# EAGLE design board (EAGLE 6.1)
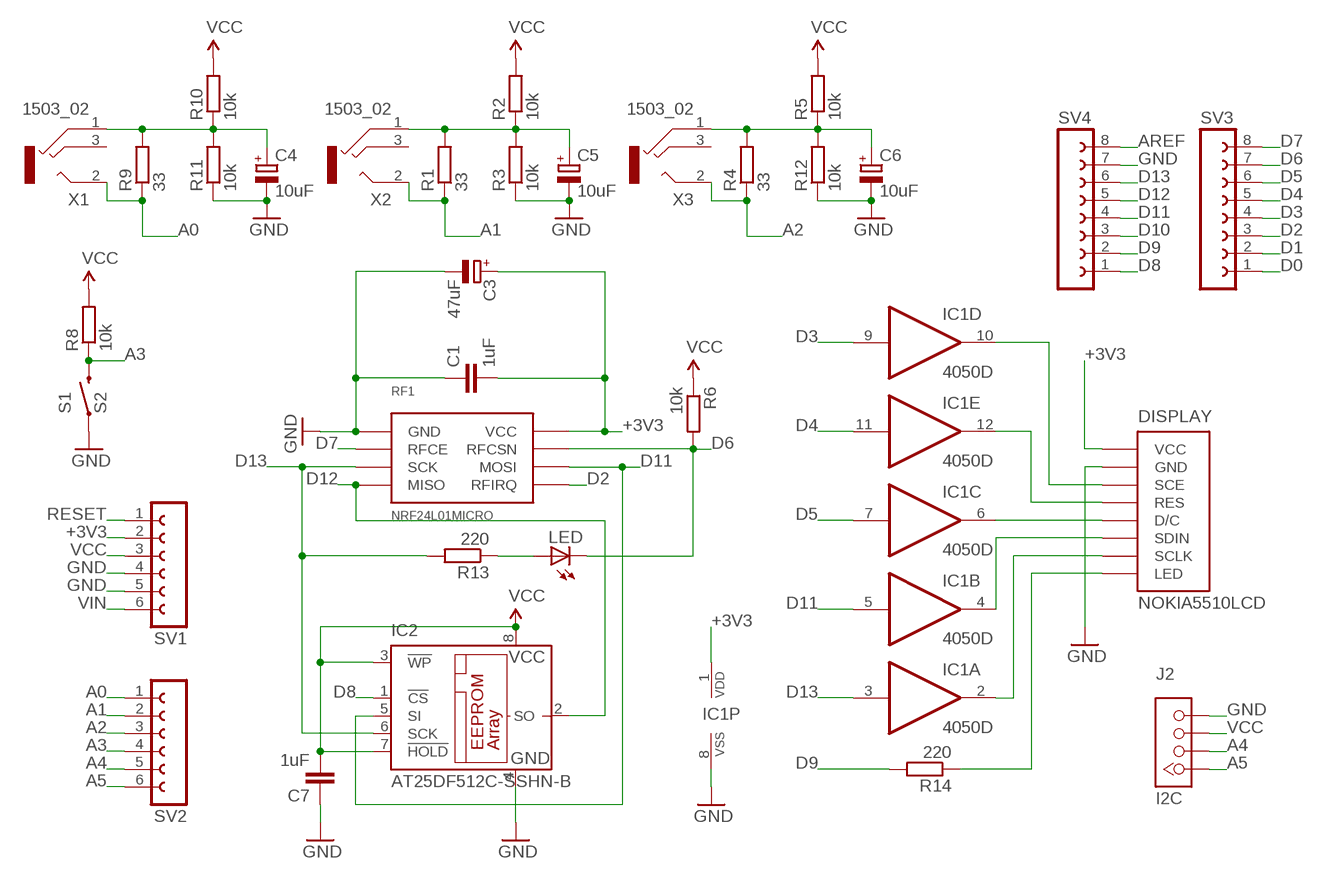
[diagram p0: schematic, sheet 1]

## Parts
C1  1uF  C-EUC0805  [C0805]
C3  47uF  CPOL-EU153CLV-0405  [153CLV-0405]
C4  10uF  CPOL-EU153CLV-0405  [153CLV-0405]
C5  10uF  CPOL-EU153CLV-0405  [153CLV-0405]
C6  10uF  CPOL-EU153CLV-0405  [153CLV-0405]
C7  1uF  C-EUC0805  [C0805]
DISPLAY  NOKIA5510LCD  NOKIA5510LCD-BLUE  [NOKIA5510LCD-BLUE]
IC1  4050D  [SO16]
IC2  AT25DF512C-SSHN-B  25AA080SN  [SO-08]
J2  I2C  TWIG-4P-2.0C  [TWIG-4P-2.0C]
LED  LEDCHIPLED_0805  [CHIPLED_0805]
R1  33  R-EU_M0805  [M0805]
R2  10k  R-EU_M0805  [M0805]
R3  10k  R-EU_M0805  [M0805]
R4  33  R-EU_M0805  [M0805]
R5  10k  R-EU_M0805  [M0805]
R6  10k  R-EU_M0805  [M0805]
R8  10k  R-EU_M0805  [M0805]
R9  33  R-EU_M0805  [M0805]
R10  10k  R-EU_M0805  [M0805]
R11  10k  R-EU_M0805  [M0805]
R12  10k  R-EU_M0805  [M0805]
R13  220  R-EU_M0805  [M0805]
R14  220  R-EU_M0805  [M0805]
RF1  NRF24L01MICRO  [MICRO-RF24]
S1  S2  SWITCH-MOMENTARY-2SIDE_EZ  [TACTILE-PTH-SIDEEZ]
SV1  FE06-1  [FE06]
SV2  FE06-1  [FE06]
SV3  FE08-1  [FE08]
SV4  FE08-1  [FE08]
X1  1503_02  [1503_02]
X2  1503_02  [1503_02]
X3  1503_02  [1503_02]

## Nets
1: C4.+ R9.2 R10.1 R11.2 X1.1
2: C5.+ R1.2 R2.1 R3.2 X2.1
3: C6.+ R4.2 R5.1 R12.2 X3.1
+3V3: C1.2 C3.+ DISPLAY.VCC IC1.1(P:VDD) RF1.3V3(VCC) SV1.2
A0: R9.1 SV2.1 X1.2
A1: R1.1 SV2.2 X2.2
A2: R4.1 SV2.3 X3.2
A3: R8.1 S1.2 SV2.4
A4: J2.P$2 SV2.5
A5: J2.P$1 SV2.6
AREF: SV4.8
CSE: DISPLAY.CE(SCE) IC1.10(D:O)
D0: SV3.1
D1: SV3.2
D2: RF1.IRQ(RFIRQ) SV3.3
D3: IC1.9(D:I) SV3.4
D4: IC1.11(E:I) SV3.5
D5: IC1.7(C:I) SV3.6
D6: LED.C R6.2 RF1.CSN(RFCSN) SV3.7
D7: RF1.CE(RFCE) SV3.8
D8: IC2.1(!CS) SV4.1
D9: R14.2 SV4.2
D10: SV4.3
D11: IC1.5(B:I) IC2.5(SI) RF1.MOSI SV4.4
D12: IC2.2(SO) RF1.MISO SV4.5
D13: IC1.3(A:I) IC2.6(SCK) R13.2 RF1.SCK SV4.6
GND: C1.1 C3.- C4.- C5.- C6.- C7.1 DISPLAY.GND IC1.8(P:VSS) IC2.4(GND) J2.P$4 R3.1 R11.1 R12.1 RF1.GND S1.1 SV1.4 SV1.5 SV4.7
N$2: DISPLAY.BL(LED) R14.1
N$3: LED.A R13.1
N$4: DISPLAY.DC(D/C) IC1.6(C:O)
N$5: DISPLAY.DIN(SDIN) IC1.4(B:O)
N$6: DISPLAY.CLK(SCLK) IC1.2(A:O)
RESET: SV1.1
RST: DISPLAY.RST(RES) IC1.12(E:O)
VCC: C7.2 IC2.3(!WP) IC2.7(!HOLD) IC2.8(VCC) J2.P$3 R2.2 R5.2 R6.1 R8.2 R10.2 SV1.3
VIN: SV1.6
Unconnected: IC1.14(F:I) IC1.15(F:O) X1.2@2 X1.3 X2.2@2 X2.3 X3.2@2 X3.3

## Library data of the parts
C1 C7 = rcl:C-EU: CAPACITOR, European symbol
C3-C6 = rcl:CPOL-EU: POLARIZED CAPACITOR, European symbol
DISPLAY = matrix:NOKIA5510LCD-BLUE
IC1 = 40xx:4050: Hex non-inverting BUFFER
IC2 = microchip:25*: Serial EEPROM 4K/ 8K , SPI bus; MF: MICROCHIP; MPN: 25AA080/SN; OC_FARNELL: 1816072; OC_NEWARK: 92C7351
J2 = matrix:TWIG-4P-2.0
LED = adafruit:LED: LED OSRAM: - CHIPLED LG R971, LG N971, LY N971, LG Q971, LY Q971, LO R971, LY R971 LH N974, LH R974 LS Q976, LO Q976, LY Q976 LO Q996 - Hyper CHIPLED LW Q18S LB Q993, LB Q99A, LB R99A - SideLED LS A670, LO A670, LY A670, LG A670, LP A670 LB A673, LV A673, LT A673, LW A673 LH A674 LY A675 LS A676, LA A676, LO A676, LY A676, LW A676 LS A679, LY A679, LG A679 - Hyper Micro SIDELED® LS Y876, LA Y876, LO Y876, LY Y876 LT Y87S - SmartLED LW L88C, LW L88S LB L89C, LB L89S, LG L890 LS L89K, LO L89K, LY L89K LS L896, LA L896, LO L896, LY L896 - TOPLED LS T670, LO T670, LY T670, LG T670, LP T670 LSG T670, LSP T670, LSY T670, LOP T670, LYG T670 LG T671, LOG T671, LSG T671 LB T673, LV T673, LT T673, LW T673 LH T674 LS T676, LA T676, LO T676, LY T676, LB T676, LH T676, LSB T676, LW T676 LB T67C, LV T67C, LT T67C, LS T67K, LO T67K, LY T67K, LW E67C LS E67B, LA E67B, LO E67B, LY E67B, LB E67C, LV E67C, LT E67C LW T67C LS T679, LY T679, LG T679 LS T770, LO T770, LY T770, LG T770, LP T770 LB T773, LV T773, LT T773, LW T773 LH T774 LS E675, LA E675, LY E675, LS T675 LS T776, LA T776, LO T776, LY T776, LB T776 LHGB T686 LT T68C, LB T68C - Hyper Mini TOPLED® LB M676 - Mini TOPLED Santana® LG M470 LS M47K, LO M47K, LY M47K Source: http://www.osram.convergy.de/
R1-R6 R8-R14 = rcl:R-EU_: RESISTOR, European symbol
RF1 = matrix:NRF24L01
S1 = SparkFun-Electromechanical:SWITCH-MOMENTARY-2: Various NO switches- pushbuttons, reed, etc
SV1 SV2 = con-lsta:FE06-1: FEMALE HEADER; OC_FARNELL: unknown; OC_NEWARK: unknown
SV3 SV4 = con-lsta:FE08-1: FEMALE HEADER; OC_FARNELL: unknown; OC_NEWARK: unknown
X1-X3 = con-lumberg-my:1503_02: Jack connectors according to JISC 6560, 3.5 mm Klinkeneinbaukupplung nach JISC 6560, 3,5 mm, 3-polig/stereo, abgewinkelte Ausführung, Surface-Mount-Technik (SMT) Source: http://www.lumberg.com/Produkte/PDFs/1503_02.pdf; OC_FARNELL: 1216979; OC_NEWARK: unknown

## Board
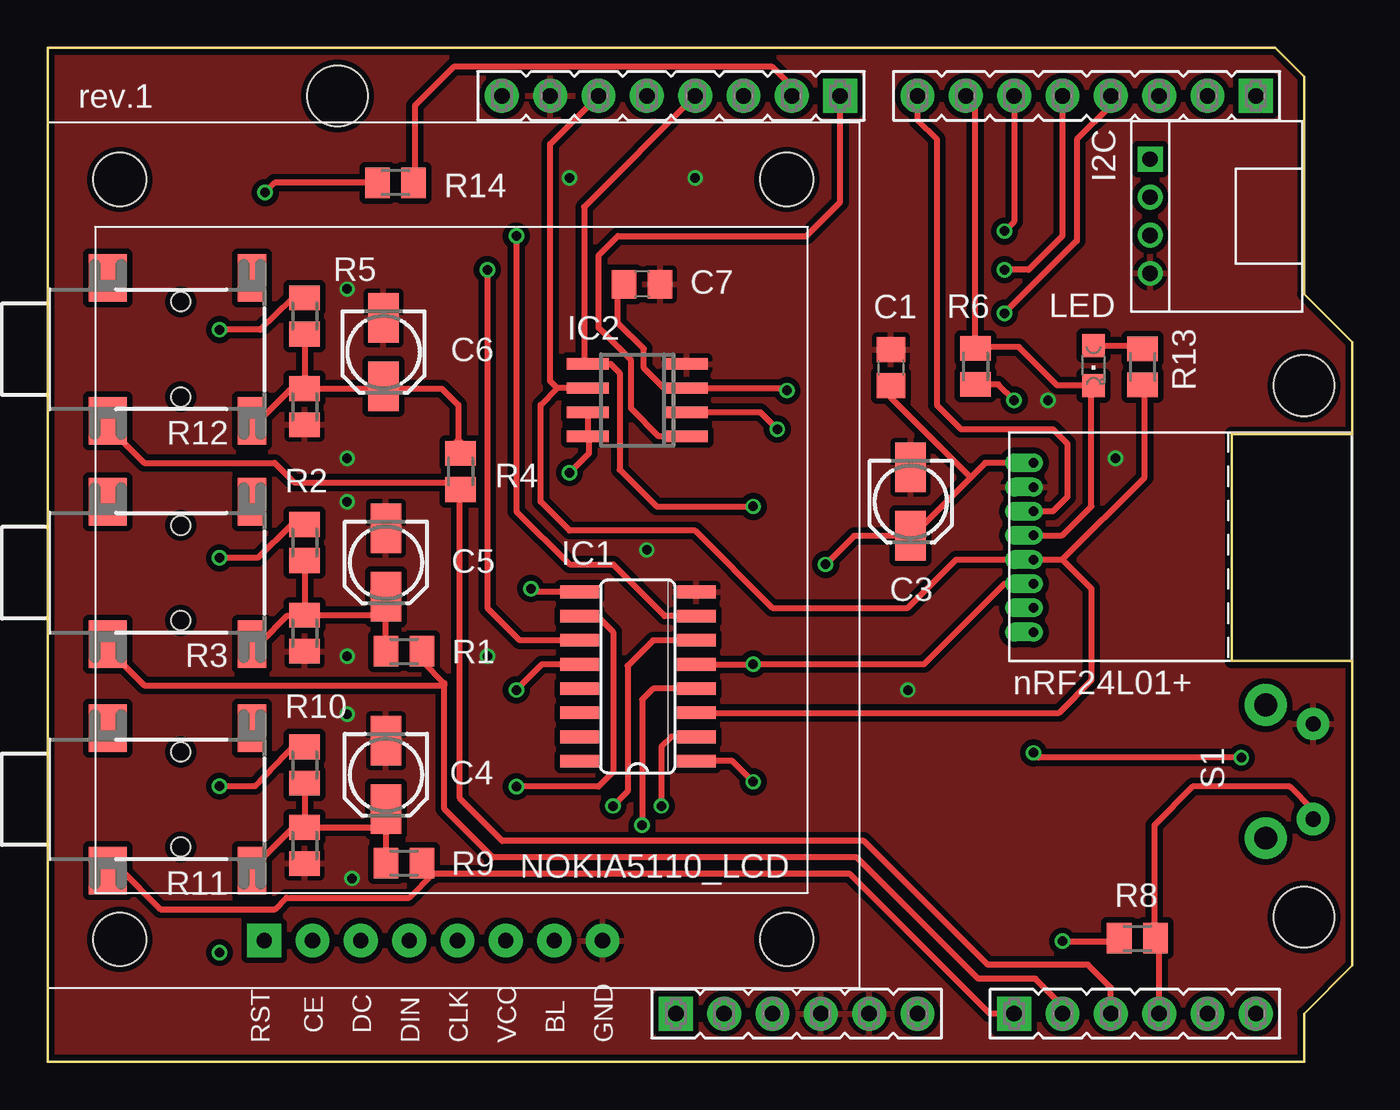
[diagram p1: board, top side]
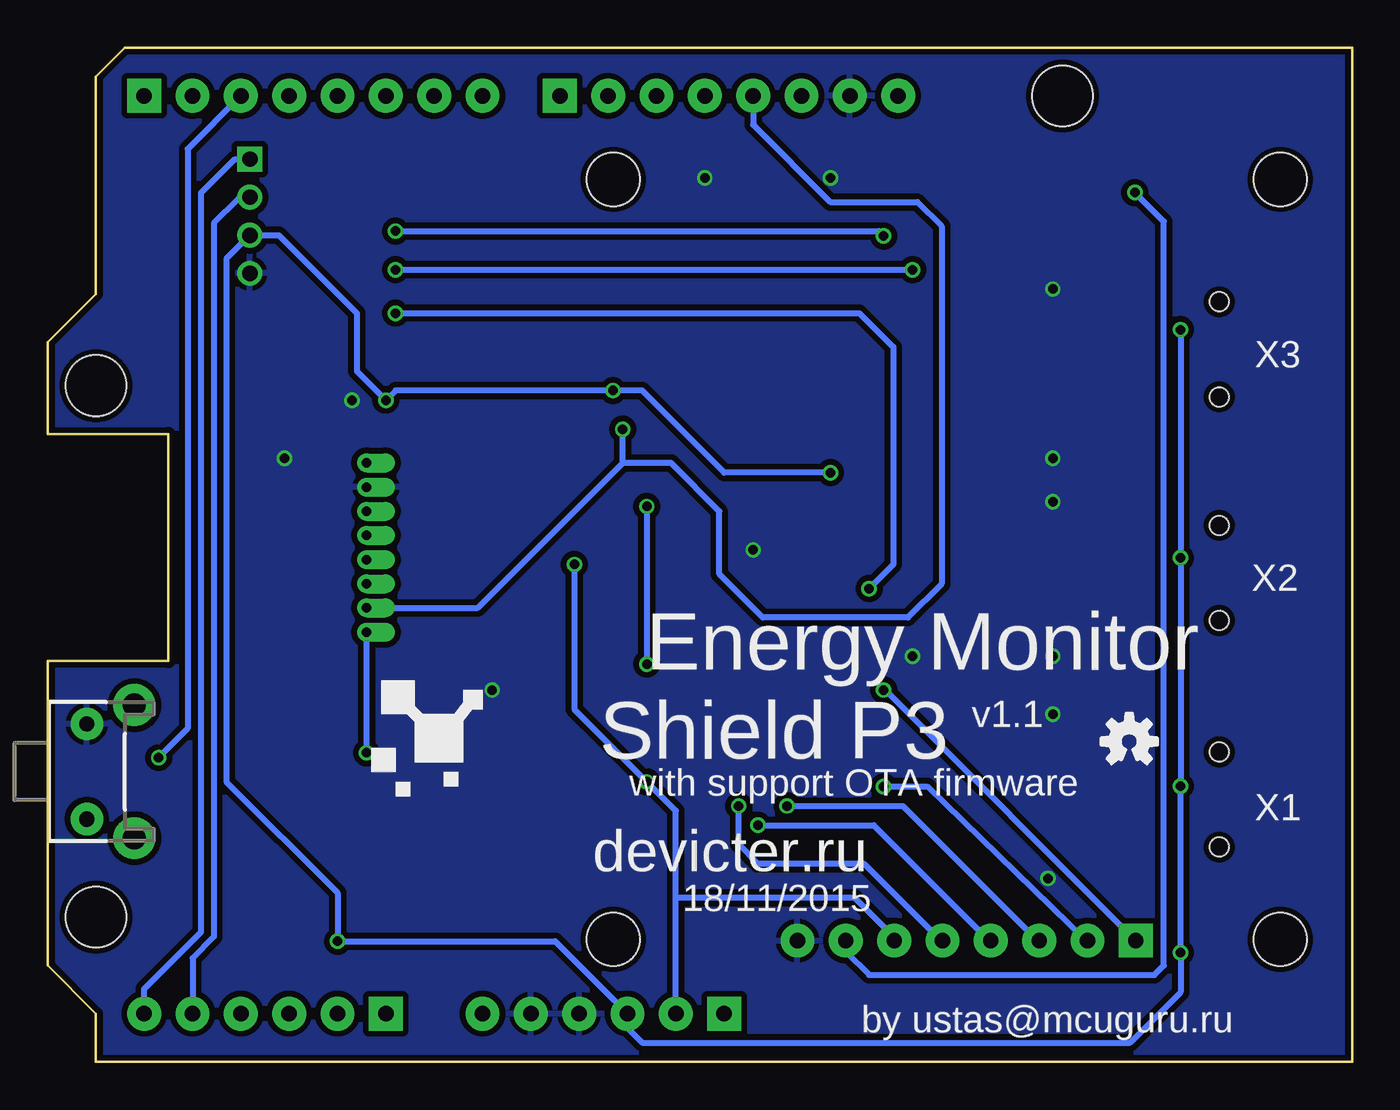
[diagram p2: board, bottom side, seen from below]

Size 68.58 x 53.34 mm. Coordinates in mm from the lower left corner, seen from the top.
Outline: 0,0 0,53.34 64.52,53.34 66.04,51.82 66.04,40.39 68.58,37.85 68.58,33.02 62.23,33.02 62.23,21.08 68.58,21.08 68.58,5.08 66.04,2.54 66.04,0 0,0
Copper layers (1*16): Top 0.035mm / dielectric 1.5mm / Bottom 0.035mm
Design rules: minimum track width 6mil, minimum drill 12mil, track to track 6mil, track to pad 6mil, pad to pad 6mil, via to via 6mil, smd to smd 0mil, copper to edge 10mil, drill to drill 10mil, minimum pad ring 10mil, minimum via ring 6mil, stop-mask expansion 2mil, vias tented up to drill 100mil, thermal gap 10mil
Holes 3.2 mm at 15.24,50.8 66.04,35.56 66.04,7.62

### Footprints (pad centres in the part's own frame; a part is rotated, then mirrored left to right if it is on the bottom)
C0805 = smd 1.3 x 1.5: 1 -0.95,0; 2 0.95,0
153CLV-0405 = smd 2.6 x 1.6: + 1.8,0; - -1.8,0
NOKIA5510LCD-BLUE = drill 0.8 pad 1.778: BL 26.627,2.48; CE 13.927,2.48; CLK 21.547,2.48; DC 16.467,2.48; DIN 19.007,2.48; GND 29.167,2.48; VCC 24.087,2.48 | drill 0.8 pad 1.778 square: RST 11.387,2.48 | hole 2.8: 3.8,2.54; 38.85,2.54; 38.85,42.5; 3.8,42.5
SO16 = smd 0.66 x 2.032: 1 -4.445,-3.073; 2 -3.175,-3.073; 3 -1.905,-3.073; 4 -0.635,-3.073; 5 0.635,-3.073; 6 1.905,-3.073; 7 3.175,-3.073; 8 4.445,-3.073; 9 4.445,3.073; 10 3.175,3.073; 11 1.905,3.073; 12 0.635,3.073; 13 -0.635,3.073; 14 -1.905,3.073; 15 -3.175,3.073; 16 -4.445,3.073
SO-08 = smd 0.6 x 2.2: 1 -1.905,-2.6; 2 -0.635,-2.6; 3 0.635,-2.6; 4 1.905,-2.6; 5 1.905,2.6; 6 0.635,2.6; 7 -0.635,2.6; 8 -1.905,2.6
TWIG-4P-2.0C = drill 0.8 square: P$1 0,0 | drill 0.8: P$2 0,2; P$3 0,4; P$4 0,6
CHIPLED_0805 = smd 1.2 x 1.2: A 0,-1.05; C 0,1.05
M0805 = smd 1.3 x 1.6: 1 -0.95,0; 2 0.95,0
MICRO-RF24 = drill 0.5 offset: 3V3 0,1.27; CE 2.54,1.27; CSN 3.81,1.27; GND 1.27,1.27; IRQ 8.89,1.27; MISO 7.62,1.27; MOSI 6.35,1.27; SCK 5.08,1.27
TACTILE-PTH-SIDEEZ = drill 0.8 pad 1.7: 1 -2.5,0; 2 2.5,0 | drill 1.2 pad 2.2: ANCHOR1 -3.5,2.5; ANCHOR2 3.5,2.5
FE06 = drill 0.813 pad 1.778 square: 1 -6.35,0 | drill 0.813 pad 1.778: 2 -3.81,0; 3 -1.27,0; 4 1.27,0; 5 3.81,0; 6 6.35,0
FE08 = drill 0.813 pad 1.778 square: 1 -8.89,0 | drill 0.813 pad 1.778: 2 -6.35,0; 3 -3.81,0; 4 -1.27,0; 5 1.27,0; 6 3.81,0; 7 6.35,0; 8 8.89,0
1503_02 = smd 2.5 x 1.5: 1 -3.75,-10.75; 3 3.75,-10.75 | smd 2.5 x 2: 2 -3.75,-3.17; 2@2 3.75,-3.17 | hole 1: -2.5,-7; 2.5,-7

### Placement (x,y rotation side)
C1  44.32,36.51 270 top
C3  45.36,29.46 270 top
C4  17.78,15.1 270 top
C5  17.78,26.26 270 top
C6  17.65,37.33 270 top
C7  31.24,40.89 180 top
DISPLAY  0,3.9 0 top
IC1  31.02,20.27 90 top
IC2  30.99,34.8 90 top
J2  57.94,47.47 180 top
LED  54.97,36.62 180 top
R1  18.73,21.59 180 top
R2  13.51,27.32 90 top
R3  13.51,22.54 90 top
R4  21.7,31.05 90 top
R5  13.51,39.23 90 top
R6  48.77,36.58 90 top
R8  57.27,6.5 180 top
R9  18.73,10.46 180 top
R10  13.51,15.61 90 top
R11  13.51,11.38 90 top
R12  13.51,34.45 90 top
R13  57.56,36.55 270 top
R14  18.29,46.23 0 top
RF1  50.55,31.5 270 top
S1  66.52,15.27 270 bottom
SV1  39.37,2.54 0 top
SV2  57.15,2.54 0 top
SV3  54.61,50.8 180 top
SV4  32.77,50.8 180 top
U$2  [OSHW-LOGO-S]  11.73,16.85 0 bottom
X1  0,13.81 90 top
X2  0,25.72 90 top
X3  0,37.47 90 top

### Tracks (layer width: path | path; a pad name or v marks a point on that pad's centre or on a via)
1
  Top 0.305: R10.1 R11.2 17.79,12.33 R9.2 | 10.62,10.06 13.01,12.45
  Top 0.61: C4.+ 17.46,13 17.79,12.33 | X1.1 10.62,10.06 | 13.01,12.45 13.72,12.45 13.72,12.44 13.82,12.34 R11.2
2
  Top 0.305: R2.1 R3.2 17.78,23.49 | R1.2 17.78,23.87 | 11.2,22.07 12.6,23.47 13.69,23.37
  Top 0.61: 17.78,23.49 17.86,23.57 17.61,24.04 | C5.+ 17.25,24.71 17.61,24.04 | 17.78,23.87 17.61,24.04 | X2.1 11.2,22.07 | 13.69,23.37 R3.2 | R1.2
3
  Top 0.305: R5.1 R12.2 17.78,35.41 20.73,35.41 21.59,34.54 21.59,32.51 | 11.11,33.72 12.7,35.31 13.41,35.31
  Top 0.61: C6.+ 17.75,35.66 17.78,35.41 | X3.1 11.11,33.72 | 13.41,35.31 R12.2 | R4.2 21.7,32.4 21.59,32.51
+3V3  (via drill 0.5)
  Top 0.305: RF1.3V3 49.28,31.5 48.51,30.73 | 48.51,30.73 45.47,27.69 45.39,27.69 C3.+ 42.39,27.66 v40.89,26.16 | v37.08,14.73 35.99,15.82 IC1.1 | C1.2 44.32,34.93 48.51,30.73
  Bottom 0.305: SV1.2 35.56,8.64 | 35.56,8.64 35.56,13.21 v37.08,14.73 40.89,18.54 v40.89,26.16 | DISPLAY.VCC 24.09,6.56 26.16,8.64 35.56,8.64
A0
  Top 0.305: SV2.1 49.51,2.54 42.16,9.89 20.26,9.89 | 20.26,9.89 R9.1 | 3.81,10.16 5.93,8.04 11.95,8.04 12.55,8.64 19,8.64 20.26,9.89
  Top 0.61: X1.2 2.64,10.06 2.75,10.16 3.81,10.16
A1
  Top 0.305: 53.34,2.95 51.91,4.38 48.91,4.38 42.53,10.75 23.41,10.75 20.86,13.31 20.86,19.81 | 20.86,19.81 20.86,19.91 19.68,21.08 R1.1 | 2.93,21.97 5.08,19.81 20.86,19.81
  Top 0.61: SV2.2 53.34,2.95 | X2.2 2.93,21.97
A2
  Top 0.305: SV2.3 55.88,3.91 54.67,5.12 49.41,5.12 42.91,11.62 23.9,11.62 21.67,13.87 21.67,29.75 21.54,30.37 | 2.86,33.72 5.08,31.5 11.94,31.5 12.95,30.48 21.54,30.48
  Top 0.61: 21.54,30.48 21.54,30.37 21.54,30.27 R4.1 | X3.2 2.86,33.72
A3
  Top 0.305: SV2.4 58.42,6.35 58.29,6.48 58.27,6.5 | 58.27,6.5 58.17,6.6 | S1.2 66.52,13.24 65.28,14.48 60.2,14.48 58.17,12.45 58.17,6.56 R8.1 58.27,6.5
A4
  Bottom 0.305: 58.01,45.4 58.54,45.4 59.84,44.1 59.84,6.58 60.96,5.46 SV2.5
  Bottom 0.406: 58.01,45.4 J2.P$2
A5
  Bottom 0.305: SV2.6 63.5,3.84 60.5,6.84 60.5,45.7 58.74,47.47 58.1,47.47
  Bottom 0.406: 58.1,47.47 57.94,47.62 J2.P$1
CSE  (via drill 0.5)
  Top 0.305: IC1.10 28.88,23.44 29.72,22.61 29.72,15.24 28.96,14.48 v24.64,14.48
  Bottom 0.305: v24.64,14.48 22.35,14.48 13.97,6.35 DISPLAY.CE
D2  (via drill 0.5)
  Top 0.305: v62.74,16 52.07,16 v51.82,16.26
  Bottom 0.305: SV3.3 61.21,48.01 61.21,17.53 v62.74,16 | v51.82,16.26 RF1.IRQ
D3  (via drill 0.5)
  Top 0.305: SV3.4 55.88,50.29 54.1,48.51 54.1,43.18 v50.29,39.37 | IC1.9 25.58,24.71 v25.4,24.89
  Bottom 0.305: v50.29,39.37 25.91,39.37 24.13,37.59 24.13,26.16 v25.4,24.89
D4  (via drill 0.5)
  Top 0.305: SV3.5 53.34,43.43 51.56,41.66 v50.29,41.66 | v23.11,41.66 23.11,23.88 24.82,22.17 IC1.11
  Bottom 0.305: v50.29,41.66 v23.11,41.66
D5  (via drill 0.5)
  Top 0.305: SV3.6 50.8,44.2 v50.29,43.69 | v24.64,43.43 24.64,28.96 27.43,26.16 29.72,26.16 32.44,23.44 IC1.7
  Bottom 0.305: v50.29,43.69 24.89,43.69 v24.64,43.43
D6
  Top 0.305: RF1.CSN 53.34,27.69 54.86,29.21 54.86,35.56 54.87,35.57 LED.C 53.08,35.57 51.05,37.59 48.33,37.59 R6.2 48.77,50.29 SV3.7
D7
  Top 0.305: SV3.8 45.72,49.53 46.74,48.51 46.74,34.54 48.01,33.27 52.83,33.27 53.59,32.51 53.59,29.72 52.83,28.96 RF1.CE
D8
  Top 0.305: IC2.1 32.13,32.89 30.67,34.36 30.67,36.9 28.96,38.61 28.96,42.42 29.97,43.43 39.88,43.43 41.66,45.21 SV4.1
D9
  Top 0.305: SV4.2 39.12,51.31 38.1,52.32 21.34,52.32 19.3,50.29 19.3,46.29 R14.2
D11  (via drill 0.5)
  Top 0.305: RF1.MOSI 50.29,25.15 46.07,20.92 v37.08,20.92 36.91,20.9 IC1.5 | SV4.4 28.19,44.96 28.19,36.9 IC2.5 29.59,36.7 30.07,36.23 30.07,31.15 32,29.21 v37.08,29.21
  Bottom 0.305: v37.08,29.21 v37.08,20.92
D12  (via drill 0.5)
  Top 0.305: IC2.2 37.47,34.16 v38.35,33.27
  Bottom 0.305: RF1.MISO 45.97,23.88 38.35,31.5 | 38.35,31.5 v38.35,33.27 | SV4.5 31.5,49.28 27.43,45.21 22.86,45.21 21.59,43.94 21.59,25.15 23.37,23.37 30.99,23.37 33.27,25.65 33.27,28.96 35.81,31.5 38.35,31.5
D13
  Top 0.305: IC2.6 26.8,35.43 | 26.8,35.43 26.42,35.81 26.42,48.26 SV4.6 | 53.34,26.42 RF1.SCK 47.75,26.42 45.21,23.88 38.1,23.88 34.04,27.94 27.43,27.94 25.91,29.46 25.91,34.54 26.8,35.43 | 53.34,26.42 54.86,24.89 54.86,20.07 53.16,18.36 IC1.3 | 53.34,26.42 57.66,30.73 57.66,35.5 R13.2
GND  (via drill 0.5)
  other vias: 15.75,18.29 15.75,29.46 15.75,40.64 15.75,31.75 15.75,21.34 16,9.65 23.11,21.34 31.5,26.92 45.21,19.56 34.04,46.48 56.13,31.75 52.58,34.8 27.43,46.48
  pour Top (isolate 0.305): -8.13,59.18 74.68,59.18 74.68,-3.05 -8.13,-3.05
  pour Bottom (isolate 0.305): -5.59,56.39 72.39,56.39 72.39,-1.78 -5.59,-1.78
N$2  (via drill 0.5)
  Top 0.305: R14.1 11.94,46.23 v11.43,45.72
  Bottom 0.305: DISPLAY.BL 26.63,5.8 25.4,4.57 10.41,4.57 9.91,5.08 9.91,44.2 v11.43,45.72
N$3
  Top 0.305: LED.A 57.07,37.67 57.4,37.34 57.66,37.34 57.56,37.44 R13.1
N$4  (via drill 0.5)
  Top 0.305: IC1.6 31.82,22.17 30.48,20.83 30.48,14.22 v29.72,13.46
  Bottom 0.305: v29.72,13.46 23.62,13.46 16.51,6.35 DISPLAY.DC
N$5  (via drill 0.5)
  Top 0.305: IC1.4 31.82,19.63 31.24,19.05 v31.24,12.45
  Bottom 0.305: v31.24,12.45 25.15,12.45 19.05,6.35 DISPLAY.DIN
N$6  (via drill 0.5)
  Top 0.305: v32.26,13.46 32.26,16.58 32.77,17.09 IC1.2
  Bottom 0.305: v32.26,13.46 32.26,11.43 31.24,10.41 25.65,10.41 21.59,6.35 DISPLAY.CLK
RST  (via drill 0.5)
  Top 0.305: IC1.12 25.98,20.9 v24.64,19.56
  Bottom 0.305: v24.64,19.56 24.56,19.56 DISPLAY.RST
VCC  (via drill 0.5)
  Top 0.305: R5.2 12.81,40.1 11.16,38.51 v9.04,38.51 | v9.04,14.5 10.91,14.5 13.04,16.75 | R2.2 12.81,28.23 11.04,26.5 v9.04,26.5 | v53.34,6.35 56.13,6.35 56.39,6.6 56.39,6.57 R8.2 | 30.1,40.77 29.97,40.64 29.97,38.86 31.33,37.5 31.33,36.48 32.39,35.43 IC2.3 38.73,35.43 v38.86,35.31 | 30.1,40.77 30.23,40.89 | C7.2 30.04,40.83 30.1,40.77 | v50.8,34.8 49.97,35.63 R6.1 | IC2.7 28.39,33.08 28.45,33.02 28.45,32.95 | 28.45,32.95 28.45,32 v27.43,30.99 | 28.45,32.95 IC2.8
  Top 0.61: 13.04,16.75 13.79,16.75 13.49,16.54 R10.2
  Bottom 0.305: v9.04,38.51 v9.04,26.5 v9.04,14.5 v9.04,5.75 9.04,3.67 11.68,1.02 37.34,1.02 38.1,1.78 SV1.3 41.91,6.35 v53.34,6.35 53.34,8.89 59.18,14.73 59.18,42.23 J2.P$3 56.42,43.47 52.32,39.37 52.32,36.32 v50.8,34.8 50.29,35.31 v38.86,35.31 37.34,35.31 33.02,30.99 v27.43,30.99

### Text on the board
tNames: rev.1 | I2C | nRF24L01+ | NOKIA5110_LCD | RST | CE | DC | DIN | CLK | VCC | BL | GND
bNames: Energy Monitor | v1.1 | Shield P3 | with support OTA firmware | devicter.ru | 18/11/2015 | by ustas@mcuguru.ru
Document: devicter.ru | D11 | D10 | D9 | D8 | D7 | D6 | D5 | D4 | D3 | A0 | A1 | A2 | A3 | A4 | A5 | EM Shield v0.9